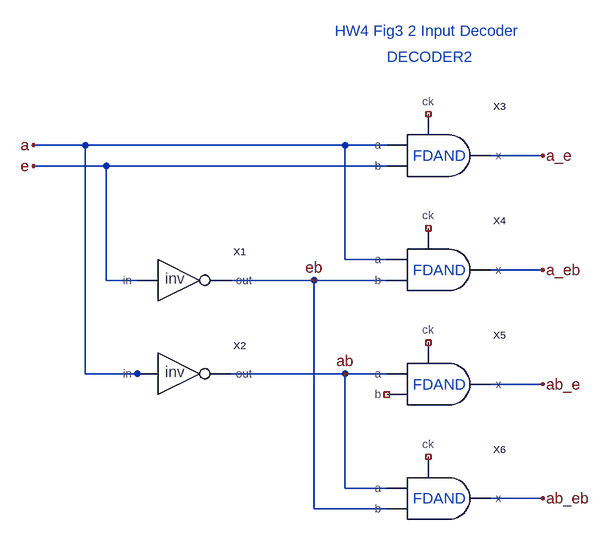
[diagram p0: schematic Draft1.asc]
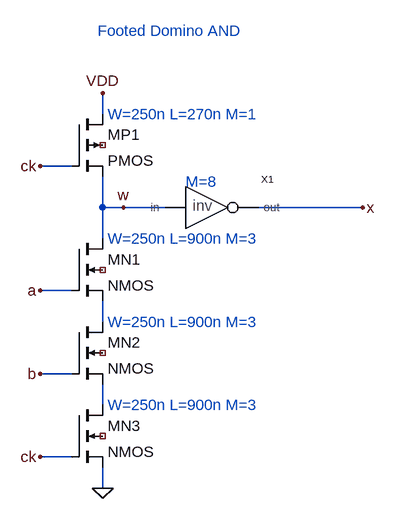
[diagram p1: sub-circuit fd_and.asc]
Draft1.asc, the LTspice schematic file:
Version 4
SHEET 1 880 972
WIRE -336 368 -416 368
WIRE 64 368 -336 368
WIRE 128 368 64 368
WIRE 368 384 288 384
WIRE -304 400 -416 400
WIRE 128 400 -304 400
WIRE 64 544 64 368
WIRE 128 544 64 544
WIRE 368 560 288 560
WIRE -304 576 -304 400
WIRE -256 576 -304 576
WIRE 16 576 -112 576
WIRE 128 576 16 576
WIRE -336 720 -336 368
WIRE -256 720 -336 720
WIRE -240 720 -256 720
WIRE 64 720 -112 720
WIRE 128 720 64 720
WIRE 368 736 288 736
WIRE 64 896 64 720
WIRE 128 896 64 896
WIRE 368 912 288 912
WIRE 16 928 16 576
WIRE 128 928 16 928
FLAG -416 368 a
FLAG -416 400 e
FLAG 368 384 a_e
FLAG 368 560 a_eb
FLAG 368 736 ab_e
FLAG 368 912 ab_eb
FLAG 16 576 eb
FLAG 64 720 ab
SYMBOL inv -160 576 R0
SYMATTR InstName X1
SYMBOL inv -160 720 R0
SYMATTR InstName X2
SYMBOL FD_AND 192 384 R0
SYMATTR InstName X3
SYMBOL FD_AND 192 560 R0
SYMATTR InstName X4
SYMBOL FD_AND 192 736 R0
SYMATTR InstName X5
SYMBOL FD_AND 192 912 R0
SYMATTR InstName X6
TEXT 168 384 Left 2 ;FDAND
TEXT 48 192 Left 2 ;HW4 Fig3 2 Input Decoder
TEXT 168 560 Left 2 ;FDAND
TEXT 168 736 Left 2 ;FDAND
TEXT 168 912 Left 2 ;FDAND
TEXT 128 232 Left 2 ;DECODER2

fd_and.asc, the sub-circuit schematic file:
Version 4
SHEET 1 1140 680
WIRE 208 -128 208 -160
WIRE 160 -48 112 -48
WIRE 208 16 208 -32
WIRE 240 16 208 16
WIRE 304 16 240 16
WIRE 608 16 448 16
WIRE 208 64 208 16
WIRE 160 144 112 144
WIRE 208 192 208 160
WIRE 160 272 112 272
WIRE 208 320 208 288
WIRE 160 400 112 400
WIRE 208 448 208 416
FLAG 112 -48 ck
FLAG 112 144 a
FLAG 112 272 b
FLAG 208 -160 VDD
FLAG 112 400 ck
FLAG 208 448 0
FLAG 240 16 w
FLAG 608 16 x
SYMBOL nmos4 160 192 R0
SYMATTR InstName MN2
SYMBOL nmos4 160 64 R0
SYMATTR InstName MN1
SYMBOL pmos4 160 -128 R0
SYMATTR InstName MP1
SYMBOL nmos4 160 320 R0
SYMATTR InstName MN3
SYMBOL inv 400 16 R0
SYMATTR InstName X1
TEXT 200 -256 Left 2 ;Footed Domino AND
TEXT 216 -128 Left 2 ;W=250n L=270n M=1
TEXT 216 64 Left 2 ;W=250n L=900n M=3
TEXT 216 192 Left 2 ;W=250n L=900n M=3
TEXT 216 320 Left 2 ;W=250n L=900n M=3
TEXT 336 -24 Left 2 ;M=8

The netlist it stands for:
* Draft1.asc
XX1 e eb inv  ; pins in out
XX2 a ab inv  ; pins in out
XX3 a e NC_01 a_e fd_and
XX4 a eb NC_02 a_eb fd_and
XX5 ab NC_03 NC_04 ab_e fd_and
XX6 ab eb NC_05 ab_eb fd_and

* block symbol definitions
.subckt fd_and a b ck x
MN2 N001 b N002 NC_01 NMOS
MN1 w a N001 NC_02 NMOS
MP1 VDD ck w NC_03 PMOS
MN3 N002 ck 0 NC_04 NMOS
XX1 w x inv  ; pins in out
* Footed Domino AND
* W=250n L=270n M=1
* W=250n L=900n M=3
* W=250n L=900n M=3
* W=250n L=900n M=3
* M=8
.ends fd_and

.model NMOS NMOS
.model PMOS PMOS
.lib standard.mos
* FDAND
* HW4 Fig3 2 Input Decoder
* FDAND
* FDAND
* FDAND
* DECODER2
.backanno
.end